# Altium schematic sheet SSM2212 Adapter.SchDoc
size A
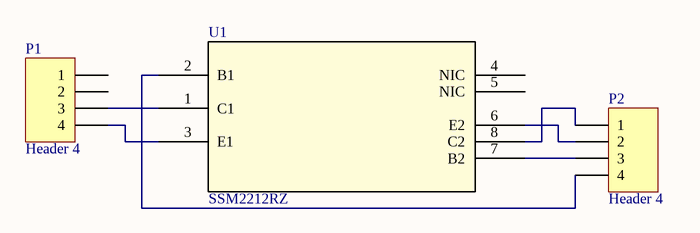
[diagram p0: SSM2212 Adapter.SchDoc]

## Parts
P1  Header 4  [HDR1X4]
P2  Header 4  [HDR1X4]
U1  SSM2212RZ  [SO8_L]

## Nets
NetP1_3: P1.3 U1.1(C1)
NetP1_4: P1.4 U1.3(E1)
NetP2_1: P2.1 U1.8(C2)
NetP2_2: P2.2 U1.6(E2)
NetP2_3: P2.3 U1.7(B2)
NetP2_4: P2.4 U1.2(B1)

Not connected (* = marked no-connect by the designer): P1 1 2; U1 4(NIC) 5(NIC)

## Library data of the parts
P1 P2 = Header 4: Header, 4-Pin; LatestRevisionDate: 17-Jul-2002; LatestRevisionNote: Re-released for DXP Platform.; Publisher: Altium Limited
U1 = SSM2212RZ: Imported; Value: Value; Type: Type; RefDes: RefDes